# EAGLE design RFM2Pi_K16 (EAGLE 6.5.0)
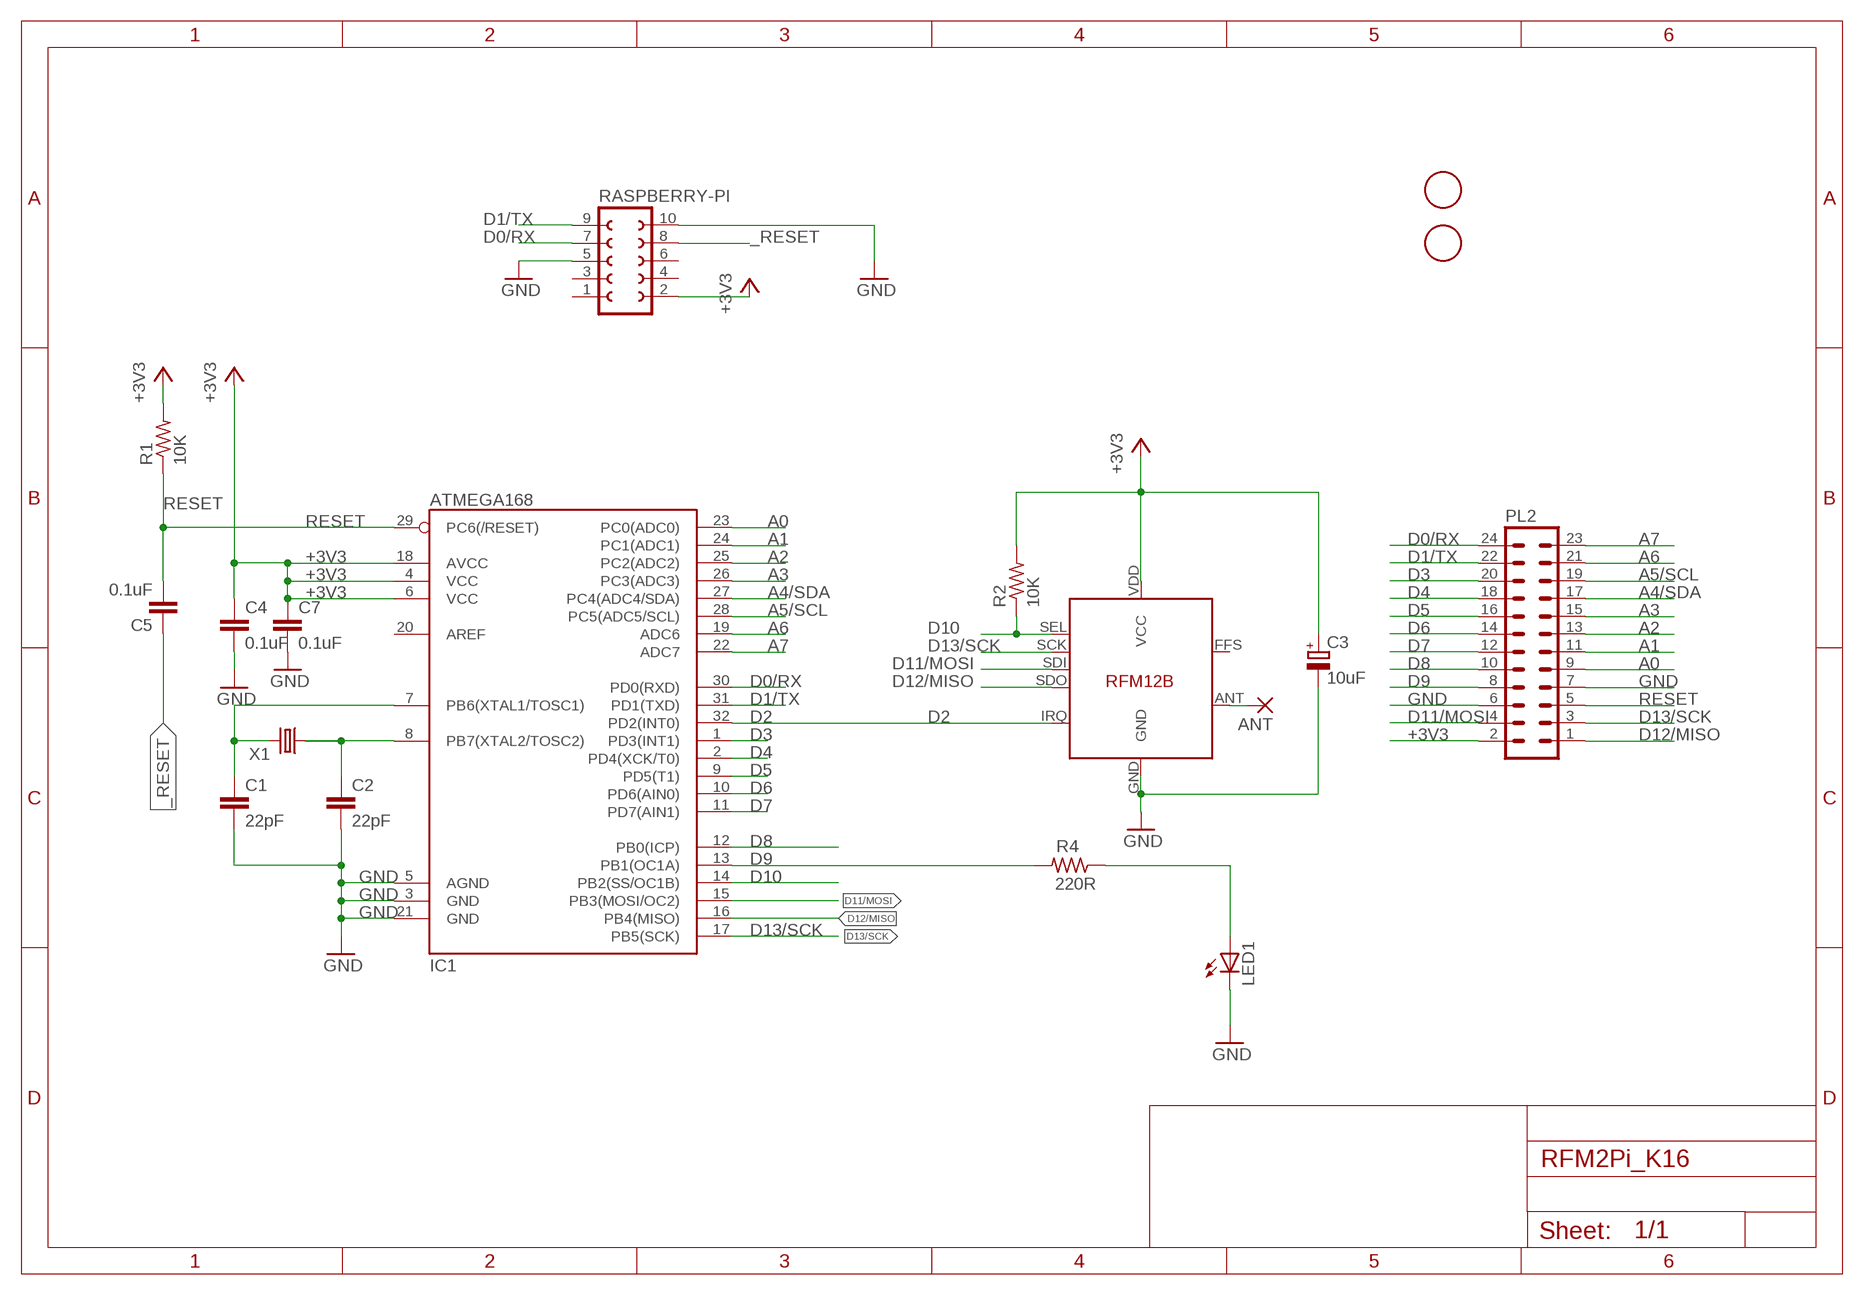
[diagram p0: schematic, sheet 1]

## Parts
ANT  1,6/0,8  [1,6/0,8]
C1  22pF  C-EUC0603  [C0603]
C2  22pF  C-EUC0603  [C0603]
C3  10uF  CPOL-EUB/3528-21W  [B/3528-21W]
C4  0.1uF  C-EUC0603  [C0603]
C5  0.1uF  C-EUC0603  [C0603]
C7  0.1uF  C-EUC0603  [C0603]
IC1  ATMEGA168  [TQFP32-08]
LED1  LEDSML0603  [SML0603]
PL2  MA12-2  [MA12-2]
R1  10K  R-US_R0603  [R0603]
R2  10K  R-US_R0603  [R0603]
R4  220R  R-US_R0603  [R0603]
RASPBERRY-PI  FE05-2  [FE05-2]
RFM12B  RFM12B  [RFM12B]
U$1  FIDUCIAL  [FIDUCIAL_1MM]
U$2  FIDUCIAL  [FIDUCIAL_1MM]
X1  CRYSTALHC49US  [HC49US]

## Nets
+3V3 [power]: C3.+ C4.1 C7.1 IC1.4(VCC) IC1.6(VCC) IC1.18(AVCC) PL2.2 R1.2 R2.2 RASPBERRY-PI.2 RFM12B.VDD(VCC)
_RESET: C5.1 RASPBERRY-PI.8
A0: IC1.23(PC0(ADC0)) PL2.9
A1: IC1.24(PC1(ADC1)) PL2.11
A2: IC1.25(PC2(ADC2)) PL2.13
A3: IC1.26(PC3(ADC3)) PL2.15
A4/SDA: IC1.27(PC4(ADC4/SDA)) PL2.17
A5/SCL: IC1.28(PC5(ADC5/SCL)) PL2.19
A6: IC1.19(ADC6) PL2.21
A7: IC1.22(ADC7) PL2.23
D0/RX: IC1.30(PD0(RXD)) PL2.24 RASPBERRY-PI.7
D1/TX: IC1.31(PD1(TXD)) PL2.22 RASPBERRY-PI.9
D2: IC1.32(PD2(INT0)) RFM12B.IRQ
D3: IC1.1(PD3(INT1)) PL2.20
D4: IC1.2(PD4(XCK/T0)) PL2.18
D5: IC1.9(PD5(T1)) PL2.16
D6: IC1.10(PD6(AIN0)) PL2.14
D7: IC1.11(PD7(AIN1)) PL2.12
D8: IC1.12(PB0(ICP)) PL2.10
D9: IC1.13(PB1(OC1A)) PL2.8 R4.2
D10: IC1.14(PB2(SS/OC1B)) R2.1 RFM12B.SEL
D11/MOSI: IC1.15(PB3(MOSI/OC2)) PL2.4 RFM12B.SDI
D12/MISO: IC1.16(PB4(MISO)) PL2.1 RFM12B.SDO
D13/SCK: IC1.17(PB5(SCK)) PL2.3 RFM12B.SCK
GND [power]: C1.2 C2.2 C3.- C4.2 C7.2 IC1.3(GND) IC1.5(AGND) IC1.21(GND) LED1.C PL2.6 PL2.7 RASPBERRY-PI.5 RASPBERRY-PI.10 RFM12B.GND
N$1: C1.1 IC1.7(PB6(XTAL1/TOSC1)) X1.2
N$2: C2.1 IC1.8(PB7(XTAL2/TOSC2)) X1.1
N$3: LED1.A R4.1
N$6 [power]: ANT.1(P) RFM12B.ANT
RESET: C5.2 IC1.29(PC6(/RESET)) PL2.5 R1.1
Unconnected: IC1.20(AREF) RASPBERRY-PI.1 RASPBERRY-PI.3 RASPBERRY-PI.4 RASPBERRY-PI.6 RFM12B.FFS

## Library data of the parts
ANT = JeeLabs:1,6/0,8: THROUGH-HOLE PAD
C1 C2 C4 C5 = rcl:C-EU: CAPACITOR, European symbol
C3 = rcl:CPOL-EU: POLARIZED CAPACITOR, European symbol
C7 = resistor:C-EU: CAPACITOR, European symbol
IC1 = SparkFun:ATMEGA168
LED1 = led:LED: LED OSRAM: - CHIPLED LG R971, LG N971, LY N971, LG Q971, LY Q971, LO R971, LY R971 LH N974, LH R974 LS Q976, LO Q976, LY Q976 LO Q996 - Hyper CHIPLED LW Q18S LB Q993, LB Q99A, LB R99A - SideLED LS A670, LO A670, LY A670, LG A670, LP A670 LB A673, LV A673, LT A673, LW A673 LH A674 LY A675 LS A676, LA A676, LO A676, LY A676, LW A676 LS A679, LY A679, LG A679 - Hyper Micro SIDELED® LS Y876, LA Y876, LO Y876, LY Y876 LT Y87S - SmartLED LW L88C, LW L88S LB L89C, LB L89S, LG L890 LS L89K, LO L89K, LY L89K LS L896, LA L896, LO L896, LY L896 - TOPLED LS T670, LO T670, LY T670, LG T670, LP T670 LSG T670, LSP T670, LSY T670, LOP T670, LYG T670 LG T671, LOG T671, LSG T671 LB T673, LV T673, LT T673, LW T673 LH T674 LS T676, LA T676, LO T676, LY T676, LB T676, LH T676, LSB T676, LW T676 LB T67C, LV T67C, LT T67C, LS T67K, LO T67K, LY T67K, LW E67C LS E67B, LA E67B, LO E67B, LY E67B, LB E67C, LV E67C, LT E67C LW T67C LS T679, LY T679, LG T679 LS T770, LO T770, LY T770, LG T770, LP T770 LB T773, LV T773, LT T773, LW T773 LH T774 LS E675, LA E675, LY E675, LS T675 LS T776, LA T776, LO T776, LY T776, LB T776 LHGB T686 LT T68C, LB T68C - Hyper Mini TOPLED® LB M676 - Mini TOPLED Santana® LG M470 LS M47K, LO M47K, LY M47K Source: http://www.osram.convergy.de LUXEON: - LUMILED® LXK2-PW12-R00, LXK2-PW12-S00, LXK2-PW14-U00, LXK2-PW14-V00 LXK2-PM12-R00, LXK2-PM12-S00, LXK2-PM14-U00 LXK2-PE12-Q00, LXK2-PE12-R00, LXK2-PE12-S00, LXK2-PE14-T00, LXK2-PE14-U00 LXK2-PB12-K00, LXK2-PB12-L00, LXK2-PB12-M00, LXK2-PB14-N00, LXK2-PB14-P00, LXK2-PB14-Q00 LXK2-PR12-L00, LXK2-PR12-M00, LXK2-PR14-Q00, LXK2-PR14-R00 LXK2-PD12-Q00, LXK2-PD12-R00, LXK2-PD12-S00 LXK2-PH12-R00, LXK2-PH12-S00 LXK2-PL12-P00, LXK2-PL12-Q00, LXK2-PL12-R00 Source: www.luxeon.com KINGBRIGHT: KA-3528ASYC Source: www.kingbright.com
PL2 = con-lstb:MA12-2: PIN HEADER; OC_FARNELL: unknown; OC_NEWARK: unknown
R1 R2 R4 = adafruit:R-US_: RESISTOR, American symbol
RASPBERRY-PI = con-lsta:FE05-2: FEMALE HEADER; OC_FARNELL: unknown; OC_NEWARK: unknown
RFM12B = JeeLabs:RFM12B
U$1 U$2 = adafruit:FIDUCIAL: For use by pick and place machines to calibrate the vision/machine, 1mm By microbuilder.eu
X1 = SparkFun:CRYSTAL: Crystals Various standard crystals. Proven footprints. Spark Fun Electronics SKU : COM-00534

## Net classes
0 default: width 0.203 mm, drill 0.203 mm, clearance 0.203 mm
1 power: width 0.254 mm, drill 0.254 mm, clearance 0.254 mm

## Board
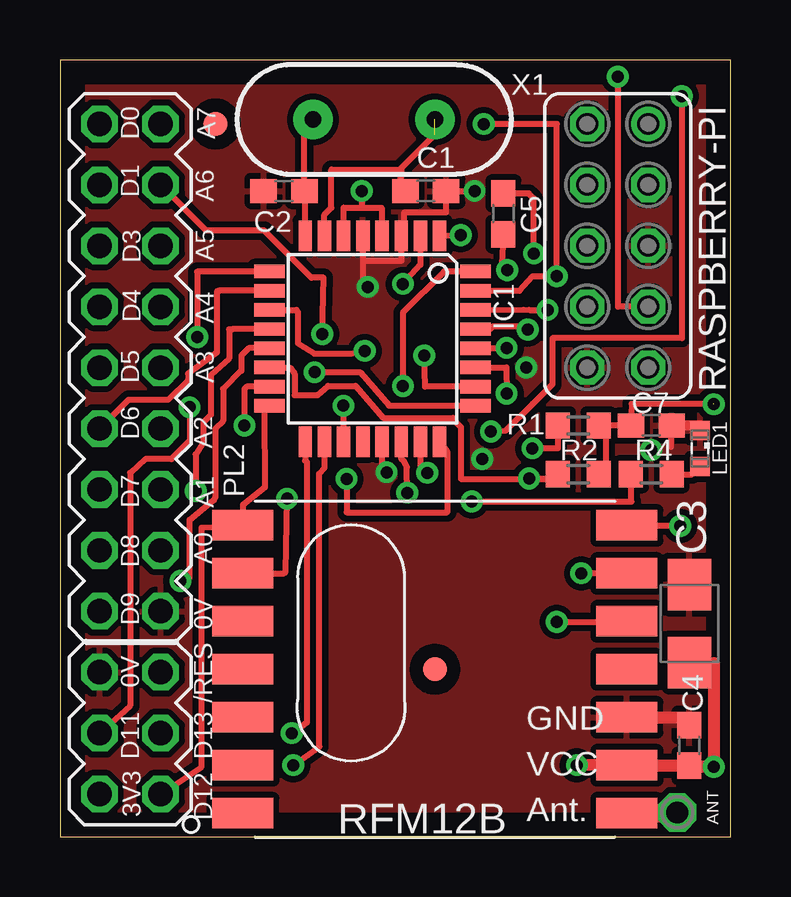
[diagram p1: board, top side]
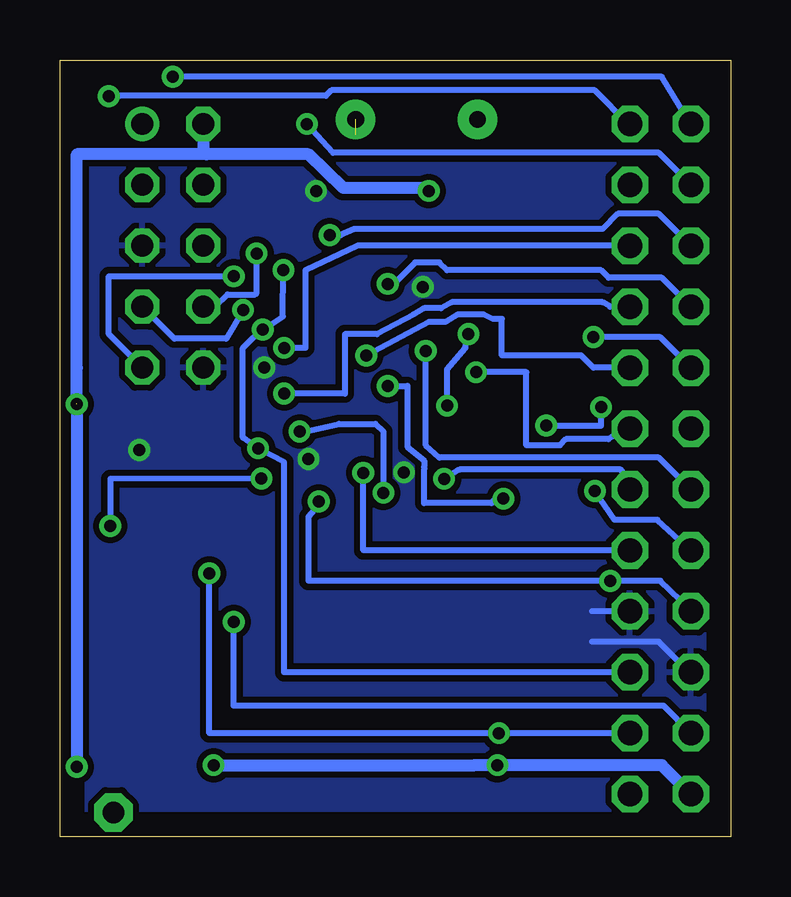
[diagram p2: board, bottom side, seen from below]

Size 27.94 x 32.38 mm. Coordinates in mm from the lower left corner, seen from the top.
Outline: 0,0 27.94,0 27.94,32.38 0,32.38 0,0
Copper layers (1*16): Top 0.035mm / dielectric 1.5mm / Bottom 0.035mm
Design rules "default *": minimum track width 10mil, minimum drill 19mil, track to track 6mil, track to pad 6mil, pad to pad 6mil, via to via 6mil, smd to smd 6mil, copper to edge 40mil, drill to drill 8mil, minimum pad ring 10mil, minimum via ring 8mil, stop-mask expansion 4mil, vias tented up to drill 0mil, thermal gap 10mil

### Footprints (pad centres in the part's own frame; a part is rotated, then mirrored left to right if it is on the bottom)
1,6/0,8 = drill 0.9 pad 1.6 octagon: 1 0,0
C0603 = smd 1.1 x 1: 1 -0.85,0; 2 0.85,0
B/3528-21W = smd 2.15 x 1.8: + 1.625,0; - -1.625,0
TQFP32-08 = smd 1.27 x 0.559: 1 -4.293,2.8; 2 -4.293,2; 3 -4.293,1.2; 4 -4.293,0.4; 5 -4.293,-0.4; 6 -4.293,-1.2; 7 -4.293,-2; 8 -4.293,-2.8; 17 4.293,-2.8; 18 4.293,-2; 19 4.293,-1.2; 20 4.293,-0.4; 21 4.293,0.4; 22 4.293,1.2; 23 4.293,2; 24 4.293,2.8 | smd 0.559 x 1.27: 9 -2.8,-4.293; 10 -2,-4.293; 11 -1.2,-4.293; 12 -0.4,-4.293; 13 0.4,-4.293; 14 1.2,-4.293; 15 2,-4.293; 16 2.8,-4.293; 25 2.8,4.293; 26 2,4.293; 27 1.2,4.293; 28 0.4,4.293; 29 -0.4,4.293; 30 -1.2,4.293; 31 -2,4.293; 32 -2.8,4.293
SML0603 = smd 0.8 x 0.8: A 0.75,0; C -0.75,0
MA12-2 = drill 1.016 octagon: 1 -13.97,-1.27; 2 -13.97,1.27; 3 -11.43,-1.27; 4 -11.43,1.27; 5 -8.89,-1.27; 6 -8.89,1.27; 7 -6.35,-1.27; 8 -6.35,1.27; 9 -3.81,-1.27; 10 -3.81,1.27; 11 -1.27,-1.27; 12 -1.27,1.27; 13 1.27,-1.27; 14 1.27,1.27; 15 3.81,-1.27; 16 3.81,1.27; 17 6.35,-1.27; 18 6.35,1.27; 19 8.89,-1.27; 20 8.89,1.27; 21 11.43,-1.27; 22 11.43,1.27; 23 13.97,-1.27; 24 13.97,1.27
R0603 = smd 1 x 1.1: 1 -0.85,0; 2 0.85,0
FE05-2 = drill 0.914: 1 -5.08,1.27 | drill 0.914 octagon: 2 -5.08,-1.27; 3 -2.54,1.27; 4 -2.54,-1.27; 5 0,1.27; 6 0,-1.27; 7 2.54,1.27; 8 2.54,-1.27; 9 5.08,1.27; 10 5.08,-1.27
RFM12B = smd 2.54 x 1.27: ANT 8,-6; FFS -8,2; GND 8,-2; IRQ -8,4; P$8 -8,0; P$9 -8,-2; P$10 -8,-4; P$12 -8,-6; P$16 8,0; SCK 8,4; SDI 8,2; SDO -8,6; SEL 8,6; VDD 8,-4
FIDUCIAL_1MM = smd 1 x 1: 1 0,0
HC49US = drill 0.7 pad 1.651: 1 -2.54,0; 2 2.54,0

### Placement (x,y rotation side)
ANT  25.72,1.02 0 top
C1  15.24,26.92 0 top
C2  9.33,26.92 180 top
C3  26.23,8.89 270 top
C4  26.23,3.81 90 top
C5  18.48,25.97 270 top
C7  24.64,17.14 0 top
IC1  13.02,20.76 270 top
LED1  26.67,16.19 270 top
PL2  2.92,15.75 90 top
R1  21.59,17.14 0 top
R2  21.59,15.11 0 top
R4  24.64,15.11 180 top
RASPBERRY-PI  23.24,24.64 270 top
RFM12B  15.62,6.99 0 top
U$1  15.62,6.99 0 top
U$2  6.48,29.72 0 top
X1  13.08,29.91 0 top

### Tracks (layer width: path | path; a pad name or v marks a point on that pad's centre or on a via)
+3V3  (via drill 0.5)  (1 unrouted)
  Top 0.254: IC1.6 11.82,26.22 11.81,26.23 12.57,26.23 | 12.57,26.23 13.4,26.23 13.4,25.08 IC1.4 | 23.65,2.96 RFM12B.VDD 23.42,3 | 22.73,17.14 R1.2 22.42,17.14 | 23.37,17.14 C7.1 | C7.1 23.81,18.06 27.24,18.06 | 26.27,2.92 C4.1 | v9.72,2.98 10.81,3.76 10.79,3.79 10.79,15.14 11.02,15.39 11.02,16.46 IC1.18 10.99,16.5 | v12.57,26.92 12.57,26.23 | C7.1 22.73,17.14 | 22.73,17.14 22.73,15.01 R2.2
  Top 0.508: C4.1 23.65,2.96 | 26.27,2.92 v27.24,2.92 27.24,7.24 C3.+ | 23.42,3 v21.54,2.98 | 27.24,18.06 v27.24,18.03
  Bottom 0.254: v9.72,2.98 10.67,2.98 | 12.7,27.05 v12.57,26.92
  Bottom 0.508: PL2.2 2.86,2.98 10.67,2.98 v21.54,2.98 | v27.24,18.03 v27.24,2.92 | v27.24,18.03 27.24,19.56 | 12.7,27.05 16.13,27.05 17.59,28.45 21.84,28.45 | 21.84,28.45 27.24,28.45 v27.24,18.03 | RASPBERRY-PI.2 21.97,28.57 21.84,28.45
_RESET  (via drill 0.5)
  Top 0.254: v19.75,24.32 19.75,26.61 19.53,26.82 C5.1
  Bottom 0.254: RASPBERRY-PI.8 21.46,22.1 20.95,22.61 19.81,22.61 19.75,22.67 v19.75,24.32
A0  (via drill 0.5)
  Top 0.254: IC1.23 15.02,15.4 v15.3,15.18
  Bottom 0.254: PL2.9 15.3,11.94 v15.3,15.18
A1  (via drill 0.5)
  Top 0.254: v11.94,14.92 11.94,13.53 16.13,13.53 16.14,16.07 IC1.24
  Bottom 0.254: PL2.11 4.19,14.8 4.57,15.3 11.3,15.3 v11.94,14.92
A2  (via drill 0.5)
  Top 0.254: v10.6,19.37 12.51,19.37 13.72,17.97 IC1.25
  Bottom 0.254: PL2.13 4.51,17.02 4.89,16.7 5.08,16.57 6.86,16.57 7.11,16.32 8.51,16.32 8.51,19.37 v10.6,19.37
A3  (via drill 0.5)
  Top 0.254: IC1.26 15.21,18.77 v15.18,20.07
  Bottom 0.254: PL2.15 5.71,19.56 6.22,20.07 9.53,20.07 9.53,21.59 9.91,21.59 10.29,21.78 11.37,21.78 11.87,21.46 12.57,21.46 v15.18,20.07
A4/SDA  (via drill 0.5)
  Top 0.254: IC1.27 18.6,19.56 v18.61,18.48
  Bottom 0.254: PL2.17 5.02,22.1 5.33,22.29 11.62,22.29 12.06,22.04 12.76,22.04 13.21,21.78 14.73,20.95 16.07,20.95 16.07,18.48 v18.61,18.48
A5/SCL  (via drill 0.5)
  Top 0.254: IC1.28 18.59,20.36 v18.61,20.38
  Bottom 0.254: PL2.19 15.56,24.64 17.72,23.62 17.72,20.38 v18.61,20.38
A6  (via drill 0.5)
  Top 0.254: IC1.19 11.82,17.52 v11.81,17.97 | v10.92,20.95 10.99,23.3 10.48,23.3 8.51,25.27 6.1,25.27 PL2.21
  Bottom 0.254: v11.81,17.97 11.81,19.49 11.05,20.38 v10.92,20.95
A7  (via drill 0.5)
  Top 0.254: v14.46,14.34 14.45,15.4 14.33,15.66 14.22,15.75 14.22,16.46 IC1.22 | v17.96,16.89 18.55,16.92 19.7,18.05 20.51,18.86 20.51,20.79 25.91,20.79 v25.91,30.87
  Bottom 0.254: PL2.23 4.25,29.72 5.65,31.11 16.64,31.11 16.87,30.89 25.45,30.89 v25.91,30.87 | v14.46,14.34 14.46,16.89 14.8,17.21 16.32,17.21 17.72,16.89 v17.96,16.89
D0/RX  (via drill 0.5)
  Top 0.254: IC1.30 19.3,21.97 19.55,21.96 v20.31,21.96 | v23.24,31.69 23.24,22.1 RASPBERRY-PI.7
  Bottom 0.254: v20.31,21.96 21.02,20.77 23.18,20.77 RASPBERRY-PI.7 | PL2.24 2.86,31.69 v23.24,31.69
D1/TX  (via drill 0.5)
  Top 0.254: IC1.31 19.14,22.77 19.68,23.37 v20.7,23.37 20.7,29.72 v17.65,29.72
  Bottom 0.254: PL2.22 2.98,28.51 16.57,28.51 v17.65,29.72 | RASPBERRY-PI.9 25.91,20.95 25.91,23.37 v20.7,23.37
D2  (via drill 0.5)
  Top 0.254: RFM12B.IRQ 9.33,10.98 9.4,11.05 v9.46,14.1 | IC1.32 16.01,23.56 14.29,21.84 v14.29,18.8
  Bottom 0.254: v9.46,14.1 9.78,14.1 9.97,13.91 12.76,13.91 12.76,15.3 12.75,15.34 12.76,15.43 12.76,15.68 13.46,16.26 13.46,18.8 v14.29,18.8
D3  (via drill 0.5)
  Top 0.254: IC1.1 16.39,25.08 v16.7,25.08
  Bottom 0.254: PL2.20 2.98,25.97 4.7,25.97 5.33,25.34 15.68,25.34 16.26,25.08 v16.7,25.08
D4  (via drill 0.5)
  Top 0.254: IC1.2 15.02,23.84 v14.29,23.05
  Bottom 0.254: PL2.18 2.86,23.3 5.08,23.3 5.4,23.62 11.81,23.62 12.13,23.94 13.14,23.94 14.03,23.05 v14.29,23.05
D5  (via drill 0.5)
  Top 0.254: IC1.9 6.79,23.56 5.71,23.56 v5.71,20.83
  Bottom 0.254: PL2.16 2.92,20.83 v5.71,20.83
D6
  Top 0.254: PL2.14 2.86,18.22 4.51,18.22 5.33,19.05 5.33,19.3 6.54,20.19 6.54,22.73 6.64,22.77 IC1.10
D7  (via drill 0.5)
  Top 0.254: v12.7,20.26 12.13,20.13 10.6,20.13 9.91,20.57 9.91,21.91 9.85,21.96 IC1.11
  Bottom 0.254: PL2.12 2.98,15.81 12.13,15.81 12.7,16.32 v12.7,20.26
D8  (via drill 0.5)
  Top 0.254: IC1.12 7.19,21.16 7.05,21.14 7.05,19.94 6.29,19.24 6.29,17.59 5.97,17.27 5.97,16.45 5.65,15.94 v5.65,14.41
  Bottom 0.254: PL2.10 3.05,13.21 4.83,13.21 v5.65,14.41
D9  (via drill 0.5)
  Top 0.254: IC1.13 7.86,20.36 7.56,20.07 7.56,19.43 6.79,18.67 6.79,17.34 6.48,17.02 6.48,14.16 6.41,14.03 5.4,13.21 5.4,10.79 5.27,10.67 v5.02,10.67 | v17.16,13.98 17.2,13.98 17.46,13.97 23.81,13.97 23.79,13.99 R4.2
  Bottom 0.254: PL2.8 1.65,9.46 2.92,10.67 v5.02,10.67 17.59,10.67 17.59,13.34 17.22,13.77 v17.16,13.98
D10  (via drill 0.5)
  Top 0.254: IC1.14 9.59,19.56 9.77,19.31 9.78,18.41 10.73,18.41 11.18,18.8 12.32,18.8 13.46,17.46 16.38,17.46 16.38,17.4 16.7,17.08 16.7,14.92 20.43,14.92 v19.55,14.94 20.57,14.92 R2.1 | 23.44,13.2 RFM12B.SEL 25.81,12.98 v25.84,12.95
  Bottom 0.254: v19.55,14.94 25.84,14.92 v25.84,12.95
D11/MOSI  (via drill 0.5)
  Top 0.254: v20.7,8.95 23.59,8.95 RFM12B.SDI | IC1.15 7.78,18.77 7.68,18.67 v7.68,17.14 | v5.4,17.91 5.4,16.51 4.64,15.75 3.56,15.75 2.92,15.18 2.92,5.46 PL2.4
  Bottom 0.254: PL2.4 2.79,5.46 20.7,5.46 v20.7,8.95 | v7.68,17.14 5.4,17.14 v5.4,17.91
D12/MISO
  Top 0.254: PL2.1 5.91,2.92 5.91,12.89 7.59,12.95 RFM12B.SDO 7.62,13.84 8.53,14.57 8.51,17.78 8.72,17.93 IC1.16
D13/SCK  (via drill 0.5)
  Top 0.254: RFM12B.SCK v21.72,10.98 v21.72,10.99 | IC1.17 10.22,15.68 10.29,15.62 10.29,4.76 9.72,4.32 v9.65,4.32
  Bottom 0.254: v21.72,10.99 21.72,4.32 v9.65,4.32 PL2.3
GND  (via drill 0.5)
  Top 0.254: C4.2 26.23,4.95 | 23.65,4.95 RFM12B.GND | 25.46,16.26 25.46,16.32 C7.2 | v17.27,26.92 C1.2 16.09,26.04 14.35,26.04 14.35,25.06 IC1.3 14.22,24.07 14.22,24 12.64,24 12.64,24.98 IC1.5 12.62,23.13 v12.83,22.92 | IC1.21 13.4,15.37 13.57,15.2 v13.61,15.2
  Top 0.406: RFM12B.GND 26.16,4.99 | 26.73,17.14 C7.2
  Top 0.508: 26.23,4.95 23.65,4.95
  Bottom 0.254: PL2.6 1.71,6.86 2.98,8.13 5.78,8.13 | PL2.7 5.78,9.4 | v12.83,22.92 12.83,22.61 | v13.61,15.2 13.4,15.3
  other vias: 17.59,15.75 19.43,19.56 24.64,16.13
  pour Top: -0.13,32.51 27.94,32.51 27.94,-0.06 -0.13,-0.06
  pour Bottom: 0,32.38 27.88,32.38 27.88,0 0,0
N$1  (1 unrouted)
  Top 0.254: IC1.7 11.02,25.94 11.3,26.23 11.3,27.81 14.22,27.81 14.2,27.46 | 14.2,27.46 14.2,27.85 15.62,29.27 | C1.1 14.2,26.86 14.2,27.46
N$2
  Top 0.254: IC1.8 10.22,26.64 C2.1 10.18,29.55 X1.1
N$3
  Top 0.254: R4.1 26.34,15.11 LED1.A
N$6
  Top 0.254: 25.68,0.98 ANT.1
  Top 0.762: RFM12B.ANT 25.68,0.98
RESET  (via drill 0.5)
  Top 0.254: v19.49,21.14 19.37,21.27 18.03,21.27 17.91,21.14 17.33,21.14 IC1.29 | v18.63,23.62 18.43,23.82 18.49,25.09 C5.2 | R1.1 20.74,16.19 v19.68,16.19 19.94,16.19
  Bottom 0.254: PL2.5 18.61,6.86 18.61,15.62 v19.68,16.19 20.32,16.64 20.32,20.38 19.94,20.77 v19.49,21.14 19.36,21.23 18.66,21.69 v18.63,23.62

### Text on the board
tNames: D0 | A7 | D1 | A6 | D3 | A5 | D4 | A4 | D5 | A3 | D6 | A2 | D7 | A1 | D8 | A0 | D9 | 0V | 0V | /RES | D11 | D13 | 3V3 | D12